# Altium schematic sheet Connectors.SchDoc
size A4; SheetNumber: 2; SheetTotal: 2
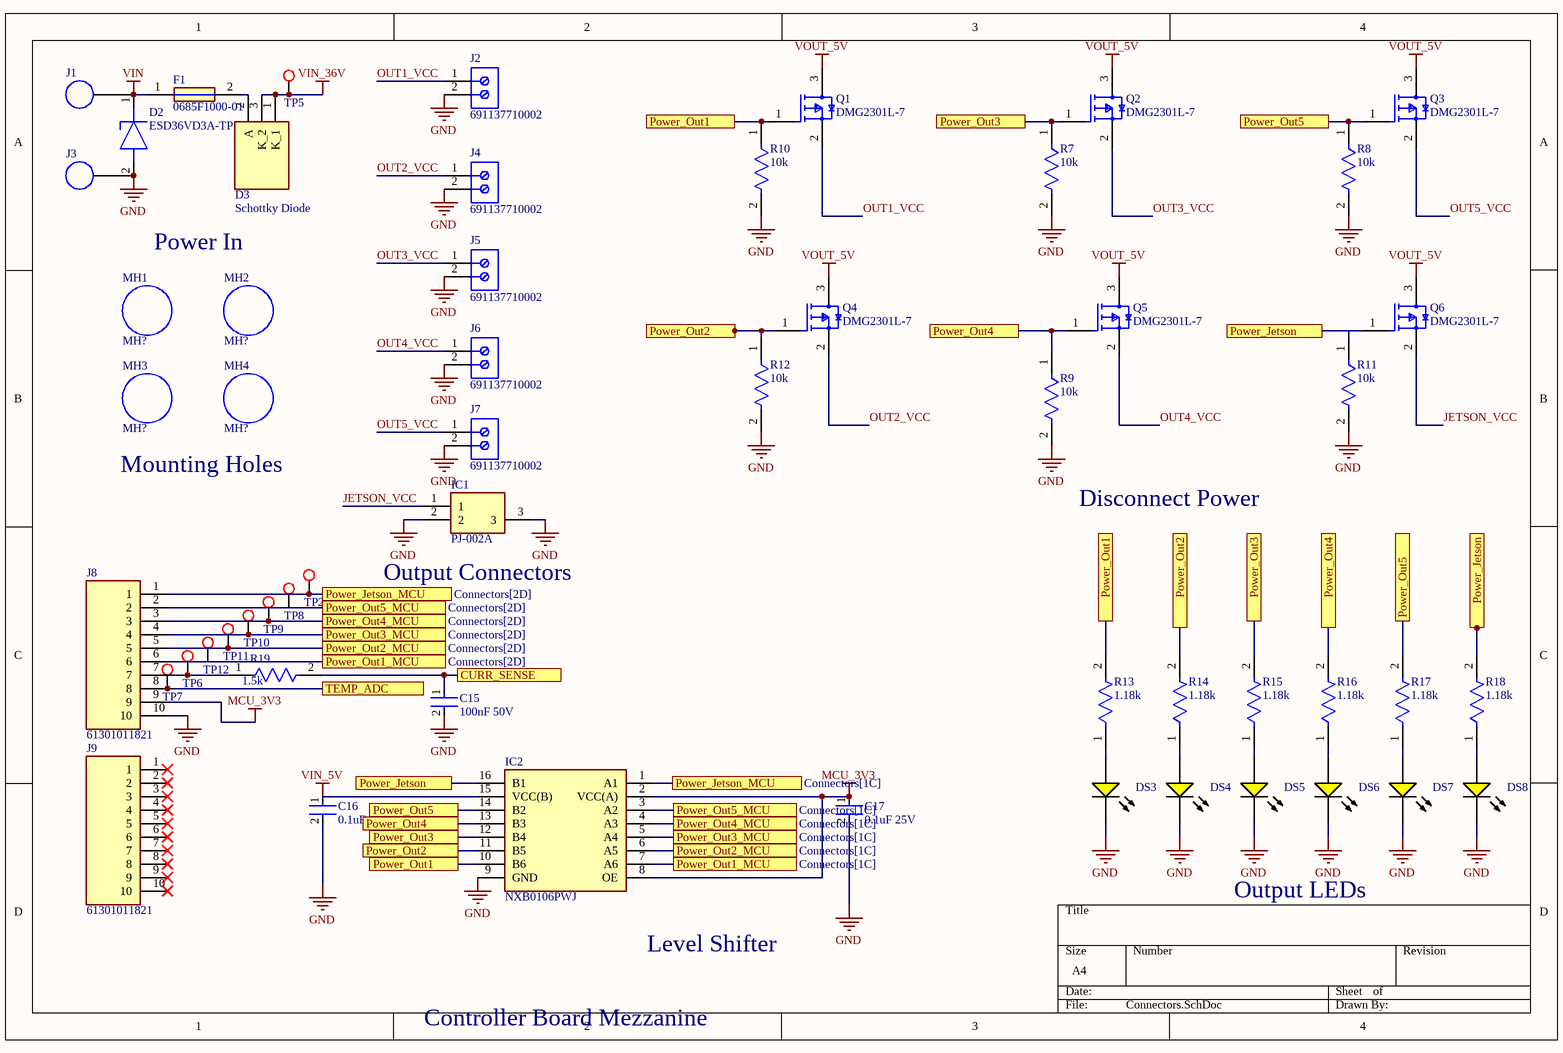
[diagram p0: Connectors.SchDoc]

## Parts
C15  100nF 50V  [FP-CL31-IPC_C]
C16  0.1uF 25V  [FP-CL21-IPC_C]
C17  0.1uF 25V  [FP-CL21-IPC_C]
D2  ESD36VD3A-TP  [SOD2512X115N]
D3  Schottky Diode  [PMEG4010EXEX]
DS3  HSMY-C190  [AVAG-HSMX-C190_V]  (value not drawn)
DS4  HSMY-C190  [AVAG-HSMX-C190_V]  (value not drawn)
DS5  HSMY-C190  [AVAG-HSMX-C190_V]  (value not drawn)
DS6  HSMY-C190  [AVAG-HSMX-C190_V]  (value not drawn)
DS7  HSMY-C190  [AVAG-HSMX-C190_V]  (value not drawn)
DS8  HSMY-C190  [AVAG-HSMX-C190_V]  (value not drawn)
F1  0685F1000-01  [FUSC3216X83N]
IC1  PJ-002A  [PJ002A]
IC2  NXB0106PWJ  [SOP65P640X110-16N]
J1  J?  [Power Screw Terminal]  (value not drawn)  (no BOM)
J2  691137710002  [691137710002]
J3  J?  [Power Screw Terminal]  (value not drawn)  (no BOM)
J4  691137710002  [691137710002]
J5  691137710002  [691137710002]
J6  691137710002  [691137710002]
J7  691137710002  [691137710002]
J8  61301011821  [RHDR10W60P0X254_1X10_2590X250X850P]
J9  61301011821  [RHDR10W60P0X254_1X10_2590X250X850P]
MH1  MH?  [Mounting Hole]  (no BOM)
MH2  MH?  [Mounting Hole]  (no BOM)
MH3  MH?  [Mounting Hole]  (no BOM)
MH4  MH?  [Mounting Hole]  (no BOM)
Q1  DMG2301L-7  [FP-SOT23-MFG]
Q2  DMG2301L-7  [FP-SOT23-MFG]
Q3  DMG2301L-7  [FP-SOT23-MFG]
Q4  DMG2301L-7  [FP-SOT23-MFG]
Q5  DMG2301L-7  [FP-SOT23-MFG]
Q6  DMG2301L-7  [FP-SOT23-MFG]
R7  10k  [FP-MC01W0805-IPC_C]
R8  10k  [FP-MC01W0805-IPC_C]
R9  10k  [FP-MC01W0805-IPC_C]
R10  10k  [FP-MC01W0805-IPC_C]
R11  10k  [FP-MC01W0805-IPC_C]
R12  10k  [FP-MC01W0805-IPC_C]
R13  1.18k  [FP-CPF0603-MFG]
R14  1.18k  [FP-CPF0603-MFG]
R15  1.18k  [FP-CPF0603-MFG]
R16  1.18k  [FP-CPF0603-MFG]
R17  1.18k  [FP-CPF0603-MFG]
R18  1.18k  [FP-CPF0603-MFG]
R19  1.5k  [FP-CRCW0603-e3-IPC_A]
TP2  TP  [Testpoint]  (value not drawn)
TP5  TP  [Testpoint]  (value not drawn)
TP6  TP  [Testpoint]  (value not drawn)
TP7  TP  [Testpoint]  (value not drawn)
TP8  TP  [Testpoint]  (value not drawn)
TP9  TP  [Testpoint]  (value not drawn)
TP10  TP  [Testpoint]  (value not drawn)
TP11  TP  [Testpoint]  (value not drawn)
TP12  TP  [Testpoint]  (value not drawn)

## Ports
CURR_SENSE (see LM2678[3B]), Power_Jetson (see Connectors[1D], Connectors[4B]), Power_Jetson (see Connectors[1D], Connectors[4C]), Power_Jetson (see Connectors[4B], Connectors[4C]), Power_Jetson_MCU (see Connectors[1C]), Power_Jetson_MCU (see Connectors[2D]), Power_Out1 (see Connectors[1D], Connectors[2A]), Power_Out1 (see Connectors[1D], Connectors[3C]), Power_Out1 (see Connectors[2A], Connectors[3C]), Power_Out1_MCU (see Connectors[1C]), Power_Out1_MCU (see Connectors[2D]), Power_Out2 (see Connectors[1D], Connectors[2B]), Power_Out2 (see Connectors[1D], Connectors[4C]), Power_Out2 (see Connectors[2B], Connectors[4C]), Power_Out2_MCU (see Connectors[1C]), Power_Out2_MCU (see Connectors[2D]), Power_Out3 (see Connectors[1D], Connectors[3A]), Power_Out3 (see Connectors[1D], Connectors[4C]), Power_Out3 (see Connectors[3A], Connectors[4C]), Power_Out3_MCU (see Connectors[1C]), Power_Out3_MCU (see Connectors[2D]), Power_Out4 (see Connectors[1D], Connectors[3B]), Power_Out4 (see Connectors[1D], Connectors[4C]), Power_Out4 (see Connectors[3B], Connectors[4C]), Power_Out4_MCU (see Connectors[1C]), Power_Out4_MCU (see Connectors[2D]), Power_Out5 (see Connectors[1D], Connectors[4A]), Power_Out5 (see Connectors[1D], Connectors[4C]), Power_Out5 (see Connectors[4A], Connectors[4C]), Power_Out5_MCU (see Connectors[1C]), Power_Out5_MCU (see Connectors[2D]), TEMP_ADC (see LM2678[2C])

## Nets
GND: C15.2 C16.2 C17.2 D2.2(A) DS3.2(K) DS4.2(K) DS5.2(K) DS6.2(K) DS7.2(K) DS8.2(K) IC1.2 IC1.3 IC2.9(GND) J2.2 J3.1 J4.2 J5.2 J6.2 J7.2 J8.10 R7.2 R8.2 R9.2 R10.2 R11.2 R12.2
MCU_3V3: C17.1 IC2.2(VCC(A)) IC2.8(OE) J8.9
VIN: D2.1(K) F1.1 J1.1
VIN_5V: C16.1 IC2.15(VCC(B))
VIN_36V: D3.1(K_1) D3.3(K_2) TP5.0
VOUT_5V: Q1.3(D) Q2.3(D) Q3.3(D) Q4.3(D) Q5.3(D) Q6.3(D)
CURR_SENSE: C15.1 R19.2 ; port CURR_SENSE
JETSON_VCC: IC1.1 Q6.2(S)
OUT1_VCC: J2.1 Q1.2(S)
OUT2_VCC: J4.1 Q4.2(S)
OUT3_VCC: J5.1 Q2.2(S)
OUT4_VCC: J6.1 Q5.2(S)
OUT5_VCC: J7.1 Q3.2(S)
Power_Jetson: IC2.16(B1) Q6.1(G) R11.1 R18.2 ; port Power_Jetson
Power_Jetson_MCU: IC2.1(A1) J8.1 TP2.0 ; port Power_Jetson_MCU
Power_Out1: IC2.10(B6) Q1.1(G) R10.1 R13.2 ; port Power_Out1
Power_Out1_MCU: IC2.7(A6) J8.6 TP12.0 ; port Power_Out1_MCU
Power_Out2: IC2.11(B5) Q4.1(G) R12.1 R14.2 ; port Power_Out2
Power_Out2_MCU: IC2.6(A5) J8.5 TP11.0 ; port Power_Out2_MCU
Power_Out3: IC2.12(B4) Q2.1(G) R7.1 R15.2 ; port Power_Out3
Power_Out3_MCU: IC2.5(A4) J8.4 TP10.0 ; port Power_Out3_MCU
Power_Out4: IC2.13(B3) Q5.1(G) R9.1 R16.2 ; port Power_Out4
Power_Out4_MCU: IC2.4(A3) J8.3 TP9.0 ; port Power_Out4_MCU
Power_Out5: IC2.14(B2) Q3.1(G) R8.1 R17.2 ; port Power_Out5
Power_Out5_MCU: IC2.3(A2) J8.2 TP8.0 ; port Power_Out5_MCU
TEMP_ADC: J8.8 TP7.0 ; port TEMP_ADC
NetD3_2: D3.2(A) F1.2
NetDS3_1: DS3.1(A) R13.1
NetDS4_1: DS4.1(A) R14.1
NetDS5_1: DS5.1(A) R15.1
NetDS6_1: DS6.1(A) R16.1
NetDS7_1: DS7.1(A) R17.1
NetDS8_1: DS8.1(A) R18.1
NetJ8_7: J8.7 R19.1 TP6.0

Not connected (* = marked no-connect by the designer): J9 1* 2* 3* 4* 5* 6* 7* 8* 9* 10*

## Notes on the sheet
- Power In
- Mounting Holes
- Disconnect Power
- (near IC1) Output Connectors
- Output LEDs
- Level Shifter
- Controller Board Mezzanine

## Library data of the parts
C15 = CMP-13271-001276-1: Cap Ceramic 100nF 50V X7R ±10% SMD 1206 +125°C Embossed T/R; Dielectric: X7R; Case Code (Metric): 3216; Package Quantity: 1; Thickness: 0.037inch; Depth: 1.6mm; Packaging: Tape and Reel; Capacitance: 100nF; Length: 0.126inch; Tolerance: 10%; Voltage Rating: 50V; Case Code (Imperial): 1206; Radiation Hardening: No; Width: 0.063inch; Case/Package: 1206; Max Operating Temperature: 125°C; Min Operating Temperature: -55°C; Height: 0.85mm; Mount: Surface Mount
C16 C17 = CMP-13271-002094-1: CL21 Series 0805 100nF 25V -20/+80% Tolerance Y5V Multilayer Ceramic Chip Capacitor; Tolerance: 80%; Case/Package: 0805; Width: 0.049inch; Mount: Surface Mount; Packaging: Tape and Reel; Dielectric: Y5V; Voltage Rating (DC): 25V; Thickness: 0.03inch; Lead Free: Lead Free; Package Quantity: 1; Max Operating Temperature: 85°C; Case Code (Imperial): 0805; Min Operating Temperature: -30°C; Length: 2mm; Height: 0.65mm; Radiation Hardening: No; Depth: 1.25mm; Capacitance: 100nF; Case Code (Metric): 2012; Voltage Rating: 25V
D2 = ESD36VD3A-TP: Diode ESD (Uni-directional); Manufacturer_Name: MCC; Datasheet Link: https://www.mccsemi.com/pdf/Products/ESD3V3D3A_ESD36VD3A(SOD-323).pdf; Height: 1.15mm; Manufacturer_Part_Number: ESD36VD3A-TP
D3 = PMEG6010EXEX: Manufacturer_Name: Nexperia; Datasheet Link: https://assets.nexperia.com/documents/data-sheet/PMEG4010EXE.pdf; Height: 1mm; Manufacturer_Part_Number: PMEG6010EXEX
DS3-DS8 = CMP-1744-00003-1: LED Uni-Color Yellow, 65 mW, 20 mA, -40 to 85 degC, 2-Pin SMD, RoHS, Tape and Reel; Tolerance: 1%; Voltage Rating: 50 V; Power Rating: 100 mW; Case\Package: 0603; Resistance: 390 Ohm; Min Operating Temperature: -55 degC; Length: 1.6 mm; ComponentLink3Description: Package Specification; Mount: Surface Mount; PackageReference: HSMX-C190; ComponentLink2Description: Datasheet; DatasheetVersion: Mar-12; Case Code (Metric): 1608; Pins: 2; Package Quantity: 5000; ComponentLink2URL: http://docs.avagotech.com/docs/AV02-0551EN; ComponentLink1Description: Manufacturer URL; RoHSCompliant: true; Packaging: Tape and Reel; PackageDescription: 2-Pin Surface Mount Device, Body 1.6 x 0.8 mm, Height 0.9 mm; REACH SVHC: No SVHC; ComponentLink3URL: http://www.fairchildsemi.com/dwg/MA/MA03D.pdf; Voltage Rating (DC): 50 V; Width: 0.8 mm; ComponentLink1URL: http://www.avagotech.com/; Max Operating Temperature: 155 degC; Case Code (Imperial): 0603; Height: 0.45 mm
F1 = 0685F1000-01: Fuse; Manufacturer_Name: Bel Circuit Protection; Datasheet Link: https://componentsearchengine.com/Datasheets/2/0685F1000-01.pdf; Height: 0.83mm; Manufacturer_Part_Number: 0685F1000-01; Supplier 1: Newark; Supplier Part Number 1: 48AC8477
IC1 = PJ-002A: Integrated Circuit; Manufacturer_Name: Same Sky; Datasheet Link: https://www.cui.com/product/resource/digikeypdf/pj-002a.pdf; Height: 11mm; Manufacturer_Part_Number: PJ-002A; Mouser Part Number: 490-PJ-002A; Mouser Price/Stock: https://www.mouser.co.uk/ProductDetail/CUI-Devices/PJ-002A?qs=WyjlAZoYn51CKfAix9Mngw%3D%3D; Arrow Part Number: PJ-002A; Arrow Price/Stock: https://www.arrow.com/en/products/pj-002a/cui-devices?utm_currency=USD&region=europe
IC2 = NXB0106PWJ: Integrated Circuit; Manufacturer_Name: Nexperia; Datasheet Link: https://assets.nexperia.com/documents/data-sheet/NXB0106.pdf; Height: 1.1mm; Manufacturer_Part_Number: NXB0106PWJ; Mouser Part Number: 771-NXB0106PWJ; Mouser Price/Stock: https://www.mouser.co.uk/ProductDetail/Nexperia/NXB0106PWJ?qs=HoCaDK9Nz5faiIwxolisWw%3D%3D; Arrow Part Number: NXB0106PWJ; Arrow Price/Stock: https://www.arrow.com/en/products/nxb0106pwj/nexperia?utm_currency=USD&region=nac
J1 J3 = Screw Connector
J2 J4-J7 = CMP-1502-03324-2: NexarPartId: 78871135; Voltage Rating: 300V; Number of Contacts: 2; Current Rating: 16A; Lead Pitch: 5mm; Height: 11.6mm; Packaging: Box; RoHS: Non-Compliant; Contact Material: Nickel, Tin; Max Operating Temperature: 120°C; Number of Pins: 2; Min Operating Temperature: -30°C; Number of Rows: 1
J8 J9 = 61301011821: Connector; Manufacturer_Name: Wurth Elektronik; Datasheet Link: http://katalog.we-online.de/em/datasheet/6130xx11821.pdf; Height: 8.5mm; Manufacturer_Part_Number: 61301011821; Mouser Part Number: 710-61301011821; Mouser Price/Stock: https://www.mouser.co.uk/ProductDetail/Wurth-Elektronik/61301011821?qs=W%252B2sBeLta1ZhlLR0YCzonQ%3D%3D
MH1-MH4 = Mounting Hole
Q1-Q6 = CMP-12801-000065-1: MOSFET P-CH 20V 3A SOT23; Manufacturer: Diodes Inc.; Number Of Channels: 1; Turn On Delay Time: 5ns; Drain To Source Resistance: 120mΩ; Max Junction Temp: +150°C; Gate To Source Voltage: 8V; Power Dissipation: 1.5W; Rthja Max: 83°C/W; Max Forward Diode Voltage: -1.2V; Standoff Height: 0.013mm; Threshold Vgs Min: -0.4V; Input Capacitace At Vds: 476pF @ -10V; Depletion Mode: False; Gate Charge At Vgs: 5.5nC @ -4.5V; Pulse Drain Current: -10A; Drain To Source Voltage: -20V; Continuous Drain Current: -3A; Turn Off Delay Time: 30ns; Lead Free: Yes; Package: SOT23; ComponentLink2Description: Datasheet; Device Class L3: MOSFETs; Device Class L1: Discrete Semiconductors; Manufacturer Part Number: DMG2301L-7; Automotive: No; Height: 1.1mm; Category: Trans; Temperature Range High: +150°C; Digikey Description: MOSFET P-CH 20V 3A SOT23; RoHS: TRUE; Number Of P Channels: 1; Footprint Url: https://www.diodes.com/assets/Package-Files/SOT23.pdf; Octopart: https://octopart.com/dmg2301l-7-diodes+inc.-67250456; ComponentLink2URL: https://www.diodes.com/assets/Datasheets/DMG2301L.pdf; Mouser Description: Single P-Channel 20 V 1.5 W 5.5 nC Silicon Surface Mount Mosfet - SOT-23; Drain To Source Breakdown Voltage: -20V; Threshold Vgs Max: -1.2V; Device Class L2: Transistors; Temperature: -55°C to +150°C; Temperature Range Low: -55°C
R7-R12 = CMP-12256-000003-1: Resistor, 10K, 0.1W, 1%, 0805, Reel; Resistance: 10kR; Voltage Rating: 150V; Temperature Coefficient: 100ppm/°C; Power Rating: 100mW; REACH SVHC: No SVHC; Composition: Thick Film; Max Operating Temperature: 155°C; Case/Package: 0805; Tolerance: 1%; Number of Pins: 2; Case Code (Metric): 2012; Voltage Rating (DC): 150V; Min Operating Temperature: -55°C; Width: 1.25mm; Case Code (Imperial): 0805; Packaging: Cut Tape
R13-R18 = CMP-03211-006385-1: RES SMD 1.18KΩ 1% 1/16W 0603; Manufacturer: TE Connectivity; Manufacturer Part Number: CPF0603F1K18C1; Voltage Rating: 50V; Power Rating: 0.063W; Temperature Coefficient: 50ppm/°C; Octopart: https://octopart.com/cpf0603f1k18c1-te+connectivity-7514649; ComponentLink2URL: https://www.te.com/commerce/DocumentDelivery/DDEController?Action=showdoc&DocId=Data+Sheet%7F1773200%7FM%7Fpdf%7FEnglish%7FENG_DS_1773200_M.pdf%7F3-1676481-2; Automotive: No; Ipc Land Pattern Name: RESC15580X45; octopart_url: https://octopart.com/cpf0603f1k18c1-te+connectivity-7514649; Tolerance: 1%; Device Class L1: Passive Components; Height: 0.55mm; RoHS: TRUE; Temperature Range Low: -55°C; Series: CPF; Lead Free: Yes; packaging: 1k Reel; Package: CPF0603; Temperature Range High: +155°C; Value: 1.18KΩ; Category: Res; Temperature: -55°C to +155°C; Composition: Thin Film; Device Class L3: Chip SMD Resistors; ComponentLink2Description: Datasheet; Device Class L2: Resistors; Resistance: 1.18KΩ
R19 = CMP-2000-02995-2: RES Thick Film, 1.5kΩ, 1%, 0.1W, 100ppm/°C, 0603; Working Voltage: 75V; Power Rating: 100mW; Resistance: 1.5kR; Max Operating Temperature: 155°C; Features: Automotive AEC-Q200; Min Operating Temperature: -55°C; Width: 0.033inch; Case/Package: 0603; Voltage Rating (DC): 75V; Termination: SMD/SMT; Mount: Surface Mount; Weight: 7.1E-05oz; Case Code (Metric): 1608; Height: 0.45mm; Voltage Rating: 75V; Length: 1.55mm; Package Quantity: 10; Lead Free: Lead Free; Composition: Thick Film; Packaging: Tape and Reel; Temperature Coefficient: 100ppm/°C; Tolerance: 1%; Military Standard: Not; Case Code (Imperial): 0603; Number of Terminations: 2; Max Power Dissipation: 100mW; Depth: 0.85mm; Contact Plating: Tin
TP2 TP5-TP12 = Testpoint